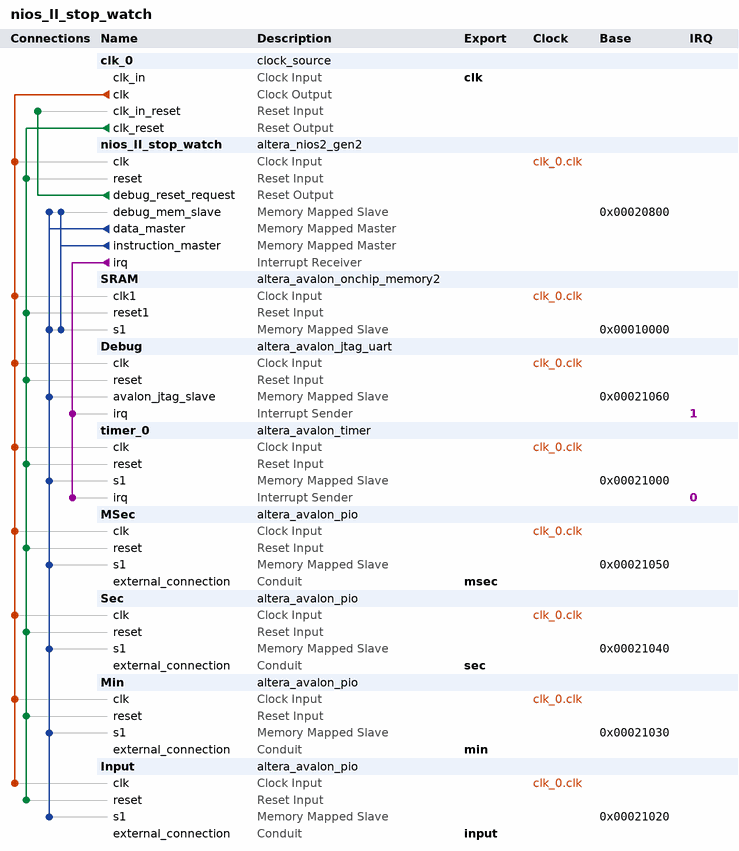
[diagram p0: system contents]
# Platform Designer (Qsys) system nios_II_stop_watch, MAX 10 10M50DAF484C7G
# Parameters at their usual value, and those the tool derives, are not listed.
package require -exact qsys 18.1
create_system nios_II_stop_watch
set_project_property DEVICE_FAMILY {MAX 10}
set_project_property DEVICE 10M50DAF484C7G

add_instance clk_0 clock_source 18.1
set_instance_parameter_value clk_0 clockFrequency 50000000

add_instance nios_II_stop_watch altera_nios2_gen2 18.1
set_instance_parameter_value nios_II_stop_watch dcache_size 2048
set_instance_parameter_value nios_II_stop_watch exceptionSlave SRAM.s1
set_instance_parameter_value nios_II_stop_watch icache_size 4096
set_instance_parameter_value nios_II_stop_watch impl Fast
set_instance_parameter_value nios_II_stop_watch resetSlave SRAM.s1

add_instance SRAM altera_avalon_onchip_memory2 18.1
set_instance_parameter_value SRAM dataWidth 32
set_instance_parameter_value SRAM dualPort false
set_instance_parameter_value SRAM initMemContent true
set_instance_parameter_value SRAM initializationFileName onchip_mem.hex
set_instance_parameter_value SRAM memorySize 40960

add_instance Debug altera_avalon_jtag_uart 18.1
set_instance_parameter_value Debug simInteractiveOptions NO_INTERACTIVE_WINDOWS

add_instance timer_0 altera_avalon_timer 18.1
set_instance_parameter_value timer_0 period 10
set_instance_parameter_value timer_0 periodUnits MSEC

add_instance MSec altera_avalon_pio 18.1
set_instance_parameter_value MSec direction Output
set_instance_parameter_value MSec width 14

add_instance Sec altera_avalon_pio 18.1
set_instance_parameter_value Sec direction Output
set_instance_parameter_value Sec width 15

add_instance Min altera_avalon_pio 18.1
set_instance_parameter_value Min direction Output
set_instance_parameter_value Min width 15

add_instance Input altera_avalon_pio 18.1
set_instance_parameter_value Input direction Input
set_instance_parameter_value Input width 2

# connections
add_connection clk_0.clk Debug.clk clock
add_connection clk_0.clk Input.clk clock
add_connection clk_0.clk Min.clk clock
add_connection clk_0.clk MSec.clk clock
add_connection clk_0.clk nios_II_stop_watch.clk clock
add_connection clk_0.clk Sec.clk clock
add_connection clk_0.clk SRAM.clk1 clock
add_connection clk_0.clk timer_0.clk clock
add_connection clk_0.clk_reset Debug.reset reset
add_connection clk_0.clk_reset Input.reset reset
add_connection clk_0.clk_reset Min.reset reset
add_connection clk_0.clk_reset MSec.reset reset
add_connection clk_0.clk_reset nios_II_stop_watch.reset reset
add_connection clk_0.clk_reset Sec.reset reset
add_connection clk_0.clk_reset SRAM.reset1 reset
add_connection clk_0.clk_reset timer_0.reset reset
add_connection nios_II_stop_watch.debug_reset_request clk_0.clk_in_reset reset
add_connection nios_II_stop_watch.data_master Debug.avalon_jtag_slave avalon
set_connection_parameter_value nios_II_stop_watch.data_master/Debug.avalon_jtag_slave baseAddress 0x00021060
add_connection nios_II_stop_watch.data_master Input.s1 avalon
set_connection_parameter_value nios_II_stop_watch.data_master/Input.s1 baseAddress 0x00021020
add_connection nios_II_stop_watch.data_master Min.s1 avalon
set_connection_parameter_value nios_II_stop_watch.data_master/Min.s1 baseAddress 0x00021030
add_connection nios_II_stop_watch.data_master MSec.s1 avalon
set_connection_parameter_value nios_II_stop_watch.data_master/MSec.s1 baseAddress 0x00021050
add_connection nios_II_stop_watch.data_master nios_II_stop_watch.debug_mem_slave avalon
set_connection_parameter_value nios_II_stop_watch.data_master/nios_II_stop_watch.debug_mem_slave baseAddress 0x00020800
add_connection nios_II_stop_watch.data_master Sec.s1 avalon
set_connection_parameter_value nios_II_stop_watch.data_master/Sec.s1 baseAddress 0x00021040
add_connection nios_II_stop_watch.data_master SRAM.s1 avalon
set_connection_parameter_value nios_II_stop_watch.data_master/SRAM.s1 baseAddress 0x00010000
add_connection nios_II_stop_watch.data_master timer_0.s1 avalon
set_connection_parameter_value nios_II_stop_watch.data_master/timer_0.s1 baseAddress 0x00021000
add_connection nios_II_stop_watch.instruction_master nios_II_stop_watch.debug_mem_slave avalon
set_connection_parameter_value nios_II_stop_watch.instruction_master/nios_II_stop_watch.debug_mem_slave baseAddress 0x00020800
add_connection nios_II_stop_watch.instruction_master SRAM.s1 avalon
set_connection_parameter_value nios_II_stop_watch.instruction_master/SRAM.s1 baseAddress 0x00010000
add_connection nios_II_stop_watch.irq Debug.irq interrupt
set_connection_parameter_value nios_II_stop_watch.irq/Debug.irq irqNumber 1
add_connection nios_II_stop_watch.irq timer_0.irq interrupt
set_connection_parameter_value nios_II_stop_watch.irq/timer_0.irq irqNumber 0

# exported interfaces
add_interface clk clock sink
set_interface_property clk EXPORT_OF clk_0.clk_in
add_interface input conduit end
set_interface_property input EXPORT_OF Input.external_connection
add_interface min conduit end
set_interface_property min EXPORT_OF Min.external_connection
add_interface msec conduit end
set_interface_property msec EXPORT_OF MSec.external_connection
add_interface sec conduit end
set_interface_property sec EXPORT_OF Sec.external_connection

set_interconnect_requirement {$system} qsys_mm.clockCrossingAdapter HANDSHAKE
set_interconnect_requirement {$system} qsys_mm.enableEccProtection FALSE
set_interconnect_requirement {$system} qsys_mm.insertDefaultSlave FALSE
set_interconnect_requirement {$system} qsys_mm.maxAdditionalLatency 1

save_system nios_II_stop_watch.qsys
